# EAGLE schematic Pentabyte_PCB_schematic (EAGLE 9.7.0)
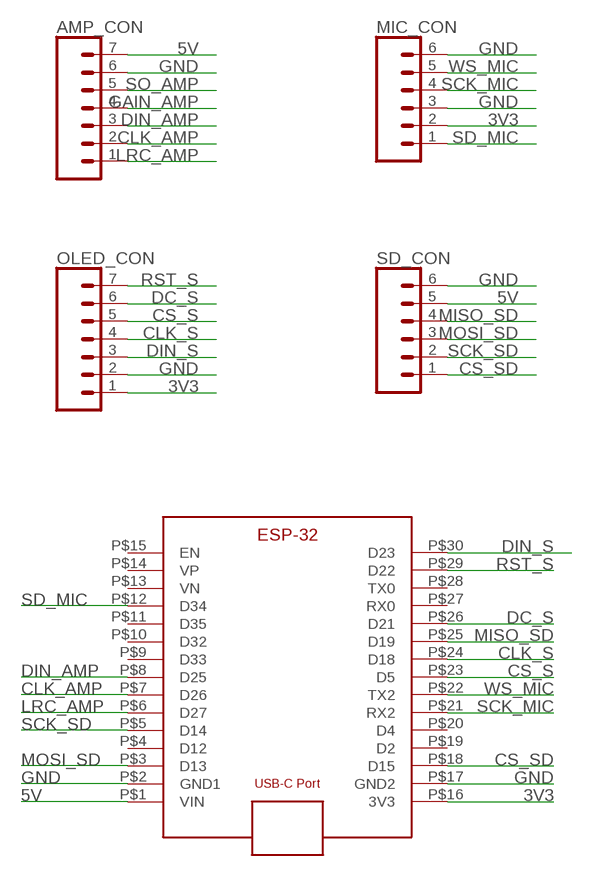
[diagram p0: schematic, sheet 1]

## Parts
AMP_CON  CONN_07  [1X07]
MIC_CON  CONN_06SILK_FEMALE_PTH  [1X06]
OLED_CON  CONN_07  [1X07]
SD_CON  CONN_06SILK_FEMALE_PTH  [1X06]
U$1  ESP-WROOM-32_DEVKITESP-WROOM-32  [ESP-WROOM-32]

## Nets
3V3: MIC_CON.2 OLED_CON.1 U$1.P$16(3V3)
5V: AMP_CON.7 SD_CON.5 U$1.P$1(VIN)
CLK_AMP: AMP_CON.2 U$1.P$7(D26)
CLK_S: OLED_CON.4 U$1.P$24(D18)
CS_S: OLED_CON.5 U$1.P$23(D5)
CS_SD: SD_CON.1 U$1.P$18(D15)
DC_S: OLED_CON.6 U$1.P$26(D21)
DIN_AMP: AMP_CON.3 U$1.P$8(D25)
DIN_S: OLED_CON.3 U$1.P$30(D23)
GAIN_AMP: AMP_CON.4
GND: AMP_CON.6 MIC_CON.3 MIC_CON.6 OLED_CON.2 SD_CON.6 U$1.P$2(GND1) U$1.P$17(GND2)
LRC_AMP: AMP_CON.1 U$1.P$6(D27)
MISO_SD: SD_CON.4 U$1.P$25(D19)
MOSI_SD: SD_CON.3 U$1.P$3(D13)
RST_S: OLED_CON.7 U$1.P$29(D22)
SCK_MIC: MIC_CON.4 U$1.P$21(RX2)
SCK_SD: SD_CON.2 U$1.P$5(D14)
SD_MIC: MIC_CON.1 U$1.P$12(D34)
SO_AMP: AMP_CON.5
WS_MIC: MIC_CON.5 U$1.P$22(TX2)
Unconnected: U$1.P$4(D12) U$1.P$9(D33) U$1.P$10(D32) U$1.P$11(D35) U$1.P$13(VN) U$1.P$14(VP) U$1.P$15(EN) U$1.P$19(D2) U$1.P$20(D4) U$1.P$27(RX0) U$1.P$28(TX0)

## Library data of the parts
AMP_CON OLED_CON = SparkFun-Connectors:CONN_07: Multi connection point. Often used as Generic Header-pin footprint for 0.1 inch spaced/style header connections On any of the 0.1 inch spaced packages, you can populate with these: Break Away Headers - Straight <https://www.sparkfun.com/products/116> (PRT-00116) Break Away Male Headers - Right Angle <https://www.sparkfun.com/products/553> (PRT-00553) Female Headers <https://www.sparkfun.com/products/115> (PRT-00115) Break Away Headers - Machine Pin <https://www.sparkfun.com/products/117> (PRT-00117) Break Away Female Headers - Swiss Machine Pin <https://www.sparkfun.com/products/743> (PRT-00743) For SCREWTERMINALS and SPRING TERMINALS visit here: Screw Terimnals on SparkFun.com <https://www.sparkfun.com/search/results?term=Screw+Terminals> (5mm/3.5mm/2.54mm spacing) This device is also useful as a general connection point to wire up your design to another part of your project. Our various solder wires solder well into these plated through hole pads. Hook-Up Wire - Assortment (Stranded, 22 AWG) <https://www.sparkfun.com/products/11375> (PRT-11375) Hook-Up Wire - Assortment (Solid Core, 22 AWG) <https://www.sparkfun.com/products/11367> (PRT-11367) View the entire wire category on our website here <https://www.sparkfun.com/categories/141> Special notes: Molex polarized connector foot print use with SKU : PRT-08231 with associated crimp pins and housings. 1MM SMD Version SKU: PRT-10208 NOTES ON THE VARIANTS LOCK and LOCK_LONGPADS... This footprint was designed to help hold the alignment of a through-hole component (i.e. 6-pin header) while soldering it into place. You may notice that each hole has been shifted either up or down by 0.005 of an inch from it's more standard position (which is a perfectly straight line). This slight alteration caused the pins (the squares in the middle) to touch the edges of the holes. Because they are alternating, it causes a "brace" to hold the component in place. 0.005 has proven to be the perfect amount of "off-center" position when using our standard breakaway headers. Although looks a little odd when you look at the bare footprint, once you have a header in there, the alteration is very hard to notice. Also,if you push a header all the way into place, it is covered up entirely on the bottom side.
MIC_CON SD_CON = SparkFun-Connectors:CONN_06: Multi connection point. Often used as Generic Header-pin footprint for 0.1 inch spaced/style header connections On any of the 0.1 inch spaced packages, you can populate with these: Break Away Headers - Straight <https://www.sparkfun.com/products/116> (PRT-00116) Break Away Male Headers - Right Angle <https://www.sparkfun.com/products/553> (PRT-00553) Female Headers <https://www.sparkfun.com/products/115> (PRT-00115) Break Away Headers - Machine Pin <https://www.sparkfun.com/products/117> (PRT-00117) Break Away Female Headers - Swiss Machine Pin <https://www.sparkfun.com/products/743> (PRT-00743) Arduino Stackable Header - 6 Pin <https://www.sparkfun.com/products/9280> (PRT-09280) Screw Terminals 2.54mm Pitch (6-Pin) <https://www.sparkfun.com/products/16499> (PRT-16499) For SCREWTERMINALS and SPRING TERMINALS visit here: Screw Terimnals on SparkFun.com <https://www.sparkfun.com/search/results?term=Screw+Terminals> (5mm/3.5mm/2.54mm spacing) This device is also useful as a general connection point to wire up your design to another part of your project. Our various solder wires solder well into these plated through hole pads. Hook-Up Wire - Assortment (Stranded, 22 AWG) <https://www.sparkfun.com/products/11375> (PRT-11375) Hook-Up Wire - Assortment (Solid Core, 22 AWG) <https://www.sparkfun.com/products/11367> (PRT-11367) View the entire wire category on our website here <https://www.sparkfun.com/categories/141>; PROD_ID: CONN-08437
U$1 = ESP-WROOM-32:ESP-WROOM-32_DEVKIT